# Altium project Robonaut_board.PrjPCB
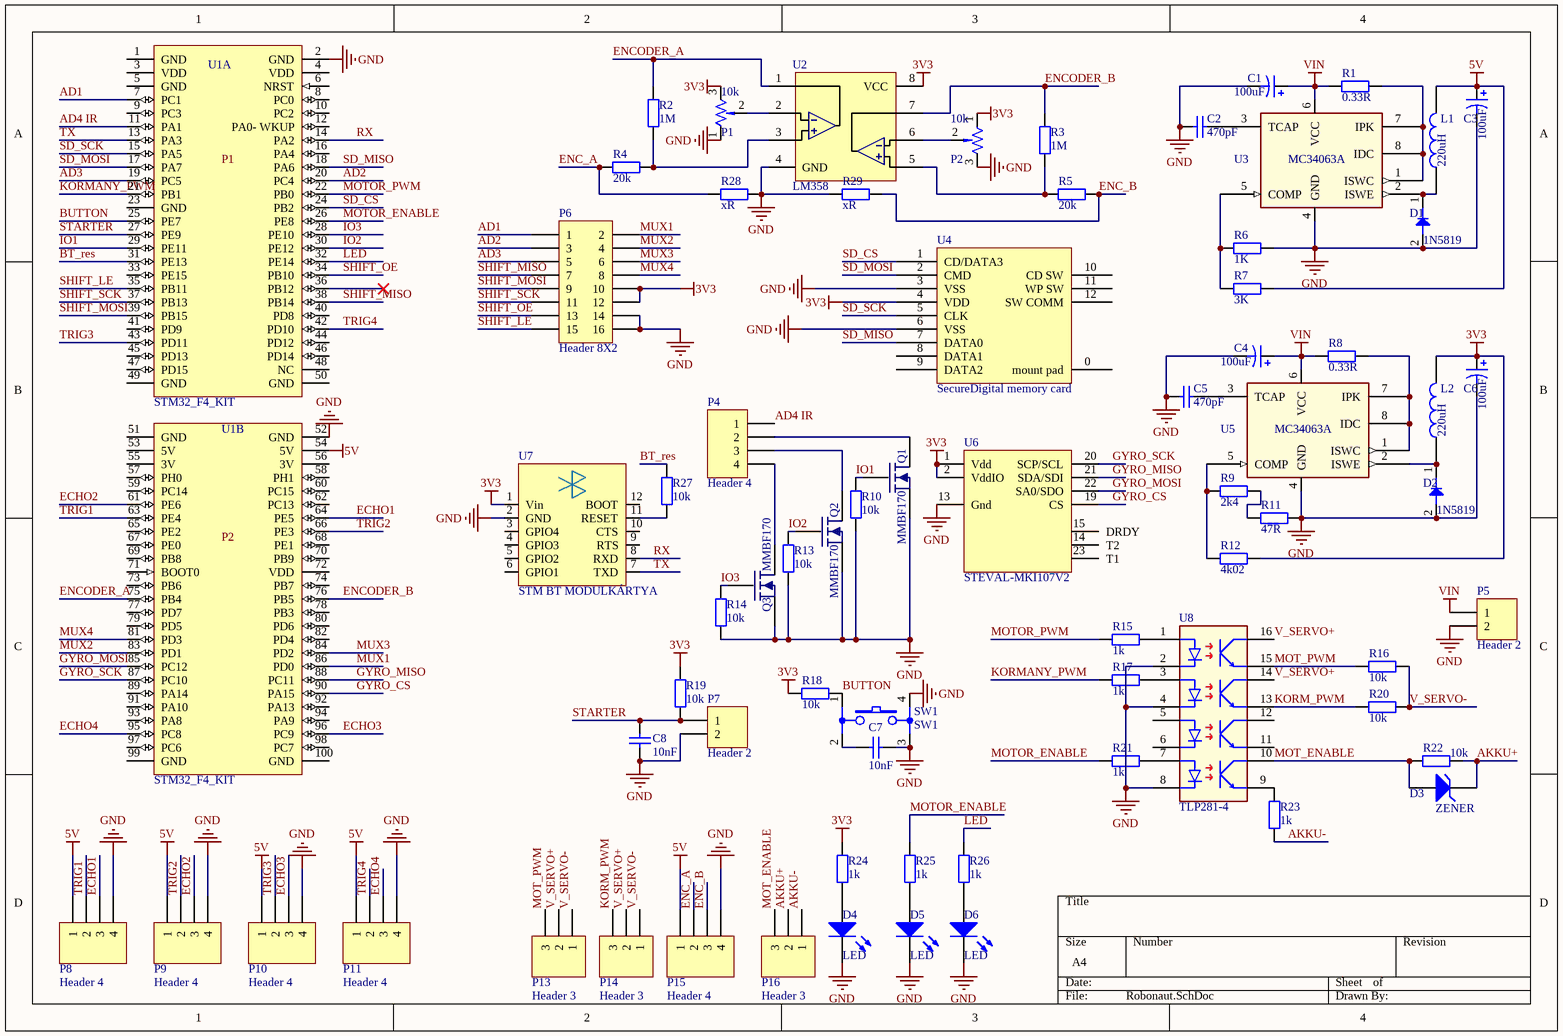
[diagram p0: Robonaut.SchDoc]
1 sheet, 71 parts. Net scope: global (net labels, ports and power ports of the same name join across sheets).
Board file: Robonaut.PcbDoc

## Sheet Robonaut.SchDoc
size A4

### Parts
C1  100uF  [FP_CAP_ELKO_6,3X6,3]
C2  470pF  [FP_0805_CAP_085]
C3  100uF  [FP_CAP_ELKO_6,3X6,3]
C4  100uF  [FP_CAP_ELKO_6,3X6,3]
C5  470pF  [FP_0805_CAP_085]
C6  100uF  [FP_CAP_ELKO_6,3X6,3]
C7  10nF  [FP_0805_CAP_085]
C8  10nF  [FP_0805_CAP_085]
D1  1N5819  [FP_SOD-123]
D2  1N5819  [FP_SOD-123]
D3  ZENER  [FP_SOD-123]
D4  LED  [FP_0805_LED_RED]
D5  LED  [FP_0805_LED_RED]
D6  LED  [FP_0805_LED_RED]
L1  220uH  [FP_IND_MURATA3131]
L2  220uH  [FP_IND_MURATA3131]
P1  10k  [Res Trimmer TH]
P2  10k  [Res Trimmer TH]
P4  Header 4  [HDR1X4]
P5  Header 2  [HDR1X2]
P6  Header 8X2  [HDR2X8]
P7  Header 2  [HDR1X2]
P8  Header 4  [HDR1X4]
P9  Header 4  [HDR1X4]
P10  Header 4  [HDR1X4]
P11  Header 4  [HDR1X4]
P13  Header 3  [HDR1X3]
P14  Header 3  [HDR1X3]
P15  Header 4  [HDR1X4]
P16  Header 3  [HDR1X3]
Q1  MMBF170  [BBMF170]
Q2  MMBF170  [BBMF170]
Q3  MMBF170  [BBMF170]
R1  0.33R  [FP_0805_RES]
R2  1M  [FP_0805_RES]
R3  1M  [FP_0805_RES]
R4  20k  [FP_0805_RES]
R5  20k  [FP_0805_RES]
R6  1K  [FP_0805_RES]
R7  3K  [FP_0805_RES]
R8  0.33R  [FP_0805_RES]
R9  2k4  [FP_0805_RES]
R10  10k  [FP_0805_RES]
R11  47R  [FP_0805_RES]
R12  4k02  [FP_0805_RES]
R13  10k  [FP_0805_RES]
R14  10k  [FP_0805_RES]
R15  1k  [FP_0805_RES]
R16  10k  [FP_0805_RES]
R17  1k  [FP_0805_RES]
R18  10k  [FP_0805_RES]
R19  10k  [FP_0805_RES]
R20  10k  [FP_0805_RES]
R21  1k  [FP_0805_RES]
R22  10k  [FP_0805_RES]
R23  1k  [FP_0805_RES]
R24  1k  [FP_0805_RES]
R25  1k  [FP_0805_RES]
R26  1k  [FP_0805_RES]
R27  10k  [FP_0805_RES]
R28  xR  [FP_0805_RES]
R29  xR  [FP_0805_RES]
SW1  SW1  [FP_TACTBTN]
U1  STM32_F4_KIT  [FP_STM32F4DISC]  (parts A,B of 2)
U2  LM358  [FP_SO8_MS012AA]
U3  MC34063A  [FP_SO8_MS012AA]
U4  SecureDigital memory card  [FP_CONN_SD]
U5  MC34063A  [FP_SO8_MS012AA]
U6  STEVAL-MKI107V2  [STEVAL-MKI107V2 DIL24 Adapter]
U7  STM BT MODULKÁRTYA  [STM BT MODUL]
U8  TLP281-4  [TLP281-4]

### Nets
3V3: C6.P L2.2 P1.3 P2.1 P6.10 P6.12 R12.2 R18.1 R19.2 R24.2 U2.8(VCC) U4.4(VDD) U6.1(Vdd) U6.2(VddIO) U7.1(Vin)
5V: C3.P L1.2 P8.1 P9.1 P10.1 P11.1 P15.1 R7.2 U1.54(5V)
GND: C1.N C2.1 C3.N C4.N C5.1 C6.N C7.2 C8.1 D1.2 D2.2 D4.2(K) D5.2(K) D6.2(K) P1.1 P2.3 P5.2 P6.14 P6.16 P7.2 P8.4 P9.4 P10.4 P11.4 P15.4 Q1.S Q2.S Q3.S R6.2 R10.1 R11.2 R13.1 R14.1 R28.2 R29.1 SW1.3 SW1.4 U1.2(GND) U1.52(GND) U2.4(GND) U3.4(GND) U4.3(VSS) U4.6(VSS) U5.4(GND) U6.13(Gnd) U7.2(GND) U8.2 U8.4 U8.8
VIN: C1.P C4.P P5.1 R1.1 R8.1 U3.6(VCC) U5.6(VCC)
AD1: P6.1 U1.7(PC1)
AD2: P6.3 U1.20(PC4)
AD3: P6.5 U1.19(PC5)
AD4 IR: P4.1 U1.11(PA1)
AKKU+: D3.2(K) P16.2 R22.2
AKKU-: P16.1 R23.1
BT_res: R27.2 U1.31(PE13)
BUTTON: R18.2 SW1.1 U1.25(PE7)
ECHO1: P8.3 U1.64(PE5)
ECHO2: P9.3 U1.61(PE6)
ECHO3: P10.3 U1.96(PC9)
ECHO4: P11.3 U1.95(PC8)
ENC_A: P15.2 R4.1 R28.1
ENC_B: P15.3 R5.2 R29.2
ENCODER_A: R2.2 U1.75(PB4) U2.1
ENCODER_B: R3.2 U1.76(PB5) U2.7
GYRO_CS: U1.90(PA15) U6.19(CS)
GYRO_MISO: U1.88(PC11) U6.21(SDA/SDI)
GYRO_MOSI: U1.85(PC12) U6.22(SA0/SDO)
GYRO_SCK: U1.87(PC10) U6.20(SCP/SCL)
IO1: Q1.G R10.2 U1.29(PE11)
IO2: Q2.G R13.2 U1.30(PE12)
IO3: Q3.G R14.2 U1.28(PE10)
KORM_PWM: P14.3 R20.1 U8.13
KORMANY_PWM: R17.1 U1.21(PB1)
LED: R26.2 U1.32(PE14)
MOT_ENABLE: D3.1(A) P16.3 R22.1 U8.10
MOT_PWM: P13.3 R16.1 U8.15
MOTOR_ENABLE: R21.1 R25.2 U1.26(PE8)
MOTOR_PWM: R15.1 U1.22(PB0)
MUX1: P6.2 U1.86(PD0)
MUX2: P6.4 U1.83(PD1)
MUX3: P6.6 U1.84(PD2)
MUX4: P6.8 U1.81(PD3)
RX: U1.14(PA2) U7.8(RXD)
SD_CS: U1.24(PB2) U4.1(CD/DATA3)
SD_MISO: U1.18(PA6) U4.7(DATA0)
SD_MOSI: U1.17(PA7) U4.2(CMD)
SD_SCK: U1.15(PA5) U4.5(CLK)
SHIFT_LE: P6.15 U1.35(PB11)
SHIFT_MISO: P6.7 U1.38(PB14)
SHIFT_MOSI: P6.9 U1.39(PB15)
SHIFT_OE: P6.13 U1.34(PB10)
SHIFT_SCK: P6.11 U1.37(PB13)
STARTER: C8.2 P7.1 R19.1 U1.27(PE9)
TRIG1: P8.2 U1.63(PE4)
TRIG2: P9.2 U1.66(PE3)
TRIG3: P10.2 U1.43(PD11)
TRIG4: P11.2 U1.42(PD10)
TX: U1.13(PA3) U7.7(TXD)
V_SERVO+: P13.2 P14.2 U8.14 U8.16
V_SERVO-: P13.1 P14.1 R16.2 R20.2
NetC2_2: C2.2 U3.3(TCAP)
NetC5_2: C5.2 U5.3(TCAP)
NetC7_1: C7.1 SW1.2
NetD1_1: D1.1 L1.1 U3.2(ISWE)
NetD2_1: D2.1 L2.1 U5.2(ISWE)
NetD4_1: D4.1(A) R24.1
NetD5_1: D5.1(A) R25.1
NetD6_1: D6.1(A) R26.1
NetP1_2: P1.2(t) U2.2
NetP2_2: P2.2(t) U2.6
NetP4_2: P4.2 Q1.D
NetP4_3: P4.3 Q2.D
NetP4_4: P4.4 Q3.D
NetR1_2: R1.2 U3.1(ISWC) U3.7(IPK) U3.8(IDC)
NetR2_1: R2.1 R4.2 U2.3
NetR3_1: R3.1 R5.1 U2.5
NetR6_1: R6.1 R7.1 U3.5(COMP)
NetR8_2: R8.2 U5.1(ISWC) U5.7(IPK) U5.8(IDC)
NetR9_1: R9.1 R12.1 U5.5(COMP)
NetR9_2: R9.2 R11.1
NetR15_2: R15.2 U8.1
NetR17_2: R17.2 U8.3
NetR21_2: R21.2 U8.7
NetR23_2: R23.2 U8.9
NetR27_1: R27.1 U7.11(RESET)

Not connected (* = marked no-connect by the designer): U1 1(GND) 3(VDD) 4(VDD) 5(GND) 6(NRST) 8(PC0) 9(PC3) 10(PC2) 12(PA0-_WKUP) 16(PA4) 23(GND) 33(PE15) 36(PB12)* 40(PD8) 41(PD9) 44(PD12) 45(PD13) 46(PD14) 47(PD15) 48(NC) 49(GND) 50(GND) 51(GND) 53(5V) 55(3V) 56(3V) 57(PH0) 58(PH1) 59(PC14) 60(PC15) 62(PC13) 65(PE2) 67(PE0) 68(PE1) 69(PB8) 70(PB9) 71(BOOT0) 72(VDD) 73(PB6) 74(PB7) 77(PD7) 78(PB3) 79(PD5) 80(PD6) 82(PD4) 89(PA14) 91(PA10) 92(PA13) 93(PA8) 94(PA9) 97(PC6) 98(PC7) 99(GND) 100(GND); U4 0(mount_pad) 8(DATA1) 9(DATA2) 10(CD_SW) 11(WP_SW) 12(SW_COMM); U6 14(T2) 15(DRDY) 23(T1); U7 3(GPIO4) 4(GPIO3) 5(GPIO2) 6(GPIO1) 9(RTS) 10(CTS) 12(BOOT); U8 5 6 11 12

### Notes on the sheet
- (in symbol STM32F4DISCOVERY, part A) P1
- (in symbol STM32F4DISCOVERY, part B) P2

### Library data of the parts
C1 C3 C4 C6 = CAP_ELECT: Polarized Capacitor; Value: 100uF
C2 C5 C7 C8 = CAP: Capacitor
  C2 C5: Value: 470pF
  C7 C8: Value: 10nF
D1 D2 = DIODE
D3 = ZENER: Zener Diode; U_Z: 24
D4-D6 = LED: Typical RED GaAs LED; pin to pad: 1>A 2>K
L1 L2 = IND: Inductor; Value: 220uH
P1 P2 = POTI: SET: 0.5; PSpiceTemplate: RT^@REFDES %1 %t {(@VALUE*(1-@SET))+.001}\nRB^@REFDES %t %2 {(@VALUE*@SET)+.001}
P4 P8-P11 P15 = Header 4: Header, 4-Pin; LatestRevisionDate: 17-Jul-2002; LatestRevisionNote: Re-released for DXP Platform.; Publisher: Altium Limited
P5 P7 = Header 2: Header, 2-Pin; LatestRevisionDate: 17-Jul-2002; LatestRevisionNote: Re-released for DXP Platform.; Publisher: Altium Limited
P6 = Header 8X2: Header, 8-Pin, Dual row; LatestRevisionDate: 17-Jul-2002; LatestRevisionNote: Re-released for DXP Platform.; Publisher: Altium Limited
P13 P14 P16 = Header 3: Header, 3-Pin; LatestRevisionDate: 17-Jul-2002; LatestRevisionNote: Re-released for DXP Platform.; Publisher: Altium Limited
Q1-Q3 = MMBF170: N fet  60V 500mA
R1-R29 = RES: Resistor
  R1 R8: Value: 0.33R
  R2 R3: Value: 1M
  R4 R5: Value: 20k
  R6: Value: 1K
  R7: Value: 3K
  R9: Value: 2k4
  R10 R13 R14 R16 R18-R20 R22 R27: Value: 10k
  R11: Value: 47R
  R12: Value: 4k02
  R15 R17 R21 R23-R26: Value: 1k
  R28 R29: Value: xR
U1 = STM32F4DISCOVERY: STM32 F4 Discovery Evaluation Kit
U2 = LM358: Low power dual operational amplifiers
U4 = SD card
U6 = STEVAL-MKI107V2: Three-axis digital output gyroscope; Manufacturer: STMicroelectronic; Voltage Supply: 2.4 V - 3.6 V; Supply Current: 6.1 mA; Manufacturer webpage: http://www.st.com/internet/evalboard/product/253478.jsp; Datasheet: .\Datasheet\L3GD20.pdf; .\Datasheet\STEVAL-MKI107V2.pdf
U7 = STM BT MODULKÁRTYA: bluetooth modulkártya
U8 = TLP281-4: Optocsatoló 4X